# Altium schematic sheet High-Side Driven Smart Switch.SchDoc
size A4; SheetNumber: 5; SheetTotal: 5
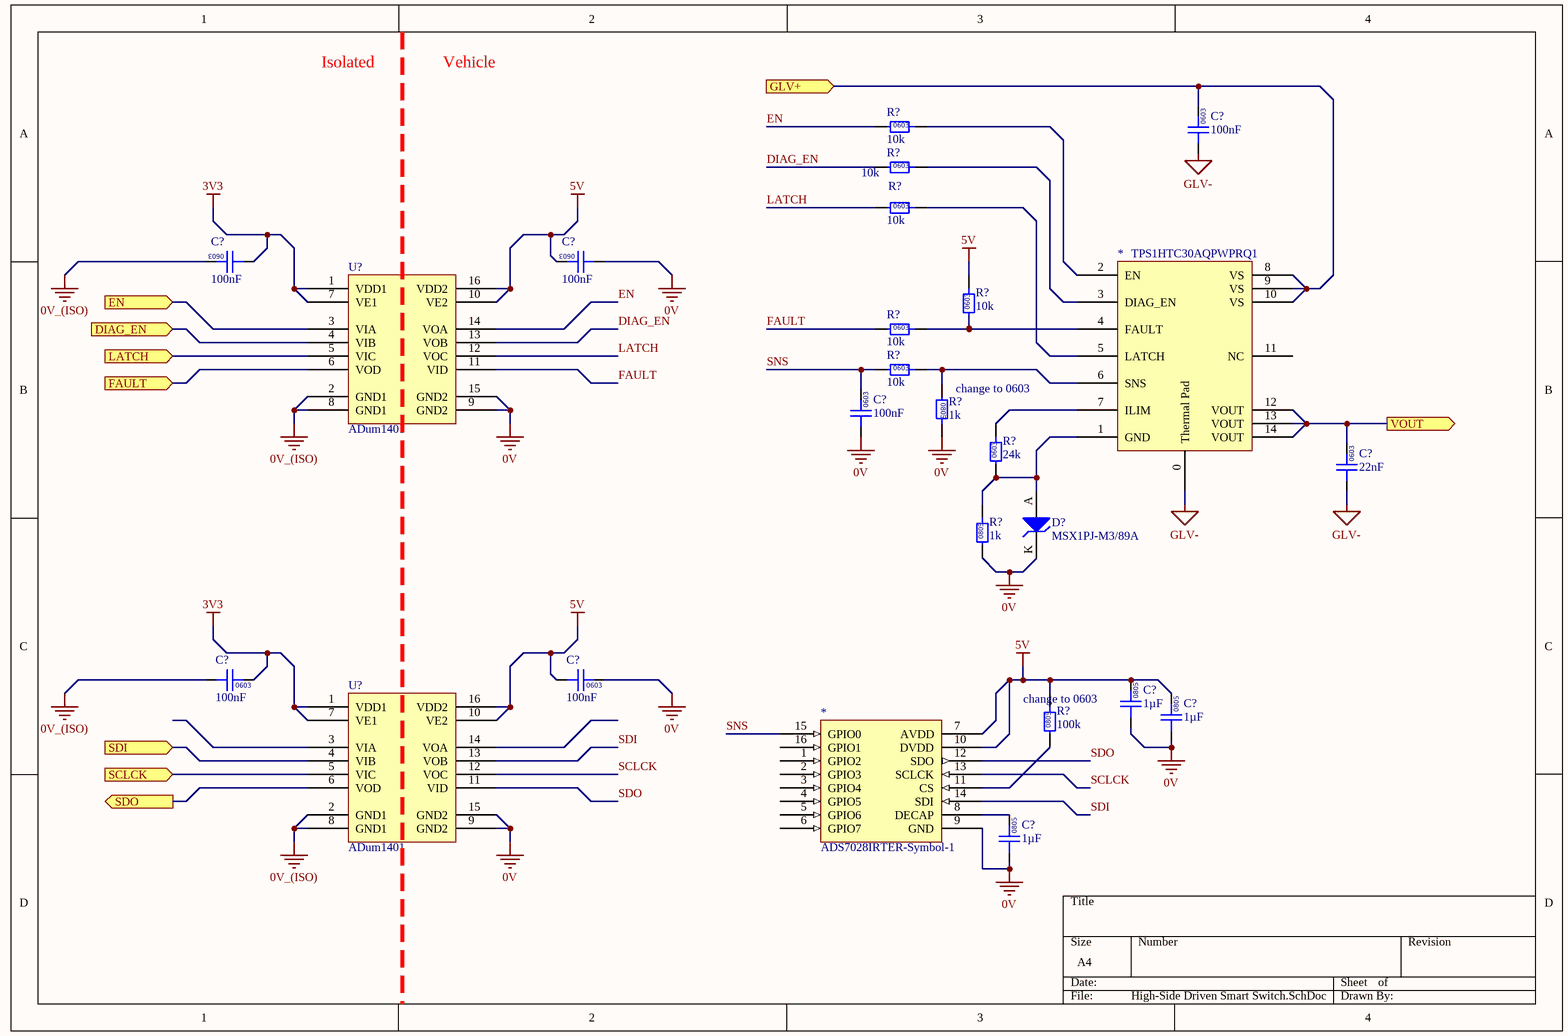
[diagram p0: High-Side Driven Smart Switch.SchDoc]

## Parts
(Parts that share a designator on the sheet are numbered #1, #2 ... from top to bottom, then left to right.)
*#1  TPS1HTC30AQPWPRQ1  [TI_TSSOP]
*#2  ADS7028IRTER-Symbol-1  [WFQN-16]
C?#1  100nF  [0603]
C?#2  100nF  [0603]
C?#3  100nF  [0603]
C?#4  100nF  [0603]
C?#5  22nF  [0603]
C?#6  100nF  [0603]
C?#7  100nF  [0603]
C?#8  1µF  [0805]
C?#9  1µF  [0805]
C?#10  1µF  [0805]
D?  MSX1PJ-M3/89A  [VISHAY DO-219]
R?#1  10k  [0603]
R?#2  10k  [0603]
R?#3  10k  [0603]
R?#4  10k  [0603]
R?#5  10k  [0603]
R?#6  10k  [0603]
R?#7  1k  [0805]
R?#8  24k  [0603]
R?#9  1k  [0805]
R?#10  100k  [0805]
U?#1  ADum1401  [AD 16-SOIC]
U?#2  ADum1401  [AD 16-SOIC]

## Ports
DIAG_EN (in), EN (in), FAULT (in), GLV+ (in), LATCH (in), SCLCK (in), SDI (in), SDO (out), VOUT (out)

## Nets
0V: *#2.9(GND) C?#3.1 C?#4.1 C?#7.2 C?#8.1 C?#9.1 C?#10.1 D?.K R?#7.2 R?#9.1 U?#1.9(GND2) U?#1.15(GND2) U?#2.9(GND2) U?#2.15(GND2)
0V_(ISO): C?#2.2 C?#6.1 U?#1.2(GND1) U?#1.8(GND1) U?#2.2(GND1) U?#2.8(GND1)
3V3: C?#2.1 C?#6.2 U?#1.1(VDD1) U?#1.7(VE1) U?#2.1(VDD1) U?#2.7(VE1)
5V: *#2.7(AVDD) *#2.10(DVDD) C?#3.2 C?#7.1 C?#8.2 C?#9.2 R?#4.2 R?#10.2 U?#1.10(VE2) U?#1.16(VDD2) U?#2.10(VE2) U?#2.16(VDD2)
GLV-: *#1.0(Thermal_Pad) C?#1.1 C?#5.1
DIAG_EN: R?#2.1 U?#1.13(VOB)
DIAG_EN: U?#1.4(VIB) ; port DIAG_EN  [a separate net that carries the same name]
EN: R?#1.1 U?#1.14(VOA)
EN: U?#1.3(VIA) ; port EN  [a separate net that carries the same name]
FAULT: R?#5.1 U?#1.11(VID)
FAULT: U?#1.6(VOD) ; port FAULT  [a separate net that carries the same name]
GLV+: *#1.8(VS) *#1.9(VS) *#1.10(VS) C?#1.2 ; port GLV+
LATCH: R?#3.1 U?#1.12(VOC)
LATCH: U?#1.5(VIC) ; port LATCH  [a separate net that carries the same name]
SCLCK: *#2.13(SCLCK) U?#2.12(VOC)
SCLCK: U?#2.5(VIC) ; port SCLCK  [a separate net that carries the same name]
SDI: *#2.14(SDI) U?#2.13(VOB)
SDI: U?#2.4(VIB) ; port SDI  [a separate net that carries the same name]
SDO: *#2.12(SDO) U?#2.11(VID)
SDO: U?#2.6(VOD) ; port SDO  [a separate net that carries the same name]
SNS: *#2.15(GPIO0) C?#4.2 R?#6.1
VOUT: *#1.12(VOUT) *#1.13(VOUT) *#1.14(VOUT) C?#5.2 ; port VOUT
Net*#1_1: *#1.1(GND) D?.A R?#8.1 R?#9.2
Net*#1_2: *#1.2(EN) R?#1.2
Net*#1_3: *#1.3(DIAG_EN) R?#2.2
Net*#1_4: *#1.4(FAULT) R?#4.1 R?#5.2
Net*#1_5: *#1.5(LATCH) R?#3.2
Net*#1_6: *#1.6(SNS) R?#6.2 R?#7.1
Net*#1_7: *#1.7(ILIM) R?#8.2
Net*#2_8: *#2.8(DECAP) C?#10.2

Not connected (* = marked no-connect by the designer): *#1 11(NC); *#2 1(GPIO2) 2(GPIO3) 3(GPIO4) 4(GPIO5) 5(GPIO6) 6(GPIO7) 11(CS) 16(GPIO1); R?#10 1; U?#2 3(VIA) 14(VOA)

## Notes on the sheet
- Isolated
- Vehicle
- (near R?#7) change to 0603
- (near R?#10) change to 0603
- (in symbol GCM21BR71H105KA03L) 0805
- (in symbol GCM188L81H104KA57D) 0603
- (in symbol GCM188R71H223KA37J) 0603
- (in symbol RC0603FR-7W24KL) 0603
- (in symbol RC0603FR-0710KL) 0603
- (in symbol RC0805FR071KL) 0805
- (in symbol RC0805FR07100KL) 0805

## Library data of the parts
*#1 = TPS1HTC30AQPWPRQ1: AUTOMOTIVE, 60-V, 6-A, 30-M, ONE; Manufacturer: Texas Instruments; Complex IC: 1; Part Number: TPS1HTC30AQPWPRQ1; Digikey Part Number: 296-TPS1HTC30AQPWPRQ1TR-ND; Digikey Link: https://www.digikey.com.au/en/products/detail/texas-instruments/TPS1HTC30AQPWPRQ1/22106757
*#2 = ADS7028IRTER: IC ADC 12BIT SAR 16WQFN; Manufacturer: Texas Instruments; Complex IC: 1; Part Number: ADS7028IRTER; Digikey Part Number: ADS7028IRTER; Digikey Link: https://www.digikey.com.au/en/products/detail/texas-instruments/ADS7028IRTER/12696020?s=N4IgTCBcDaIIIBEDKB2ADGAHASQEoBUBRXEAXQF8g
C?#1-C?#4 C?#6 C?#7 = GCM188L81H104KA57D: Manufacturer: muRata; Rated Voltage: 50V; Tolerance: ±10%; Material: MLCC; Temperature Rating: X8L; Part Number: GCM188L81H104KA57D; Value: 100nF; Digikey Part Number: 490-6049-1-ND
C?#5 = GCM188R71H223KA37J: Manufacturer: Murata Electronics; Rated Voltage: 50V; Tolerance: ±10%; Material: MLCC; Temperature Rating: X7R; Part Number: GCM188R71H223KA37J; Value: 22nF; Digikey Part Number: 490-8022-2-ND
C?#8-C?#10 = GCM21BR71H105KA03L: Manufacturer: muRata; Rated Voltage: 50V; Tolerance: ±10%; Material: MLCC; Temperature Rating: X7R; Part Number: GCM21BR71H105KA03L; Value: 1µF; Digikey Part Number: 490-10675-1-ND
D? = MSX1PJ-M3/89A: Manufacturer: Vishay General Semiconductor - Diodes Division; Breakdown Voltage: 600V; Part Number: MSX1PJ-M3/89A
R?#1-R?#6 = RC0603FR-0710KL: Manufacturer: YAGEO; Tolerance: 0.01; Rated Power: 0.1W; Part Number: RC0603FR-0710KL; Value: 10k; Material: FR-07; Digikey Part Number: 311-10.0KHRCT-ND
R?#7 R?#9 = RC0805FR071KL: Manufacturer: YAGEO; Tolerance: 0.01; Rated Power: 0.125W; Part Number: RC0805FR071KL; Value: 1k; Material: FR-07; Digikey Part Number: 311-1.00KCRCT-ND
R?#8 = RC0603FR-7W24KL: Manufacturer: YAGEO; Tolerance: 0.01; Rated Power: 0.2W; Part Number: RC0603FR-7W24KL; Value: 24k; Digikey Part Number: 13-RC0603FR-7W24KL-ND
R?#10 = RC0805FR07100KL: Manufacturer: YAGEO; Tolerance: 0.01; Rated Power: 0.125W; Part Number: RC0805FR07100KL; Value: 100k; Material: FR-07; Digikey Part Number: 311-100KCRCT-ND
U?#1 U?#2 = ADuM1401: General Purpose Digital Isolator 2500Vrms 4 Channel 1Mbps 25kV/µs CMTI 16-SOIC (0.295", 7.50mm Width); Manufacturer: Analog Devices; Complex IC: 0; Part Number: ADuM1401